# EAGLE design 8x8 (EAGLE 5.11)
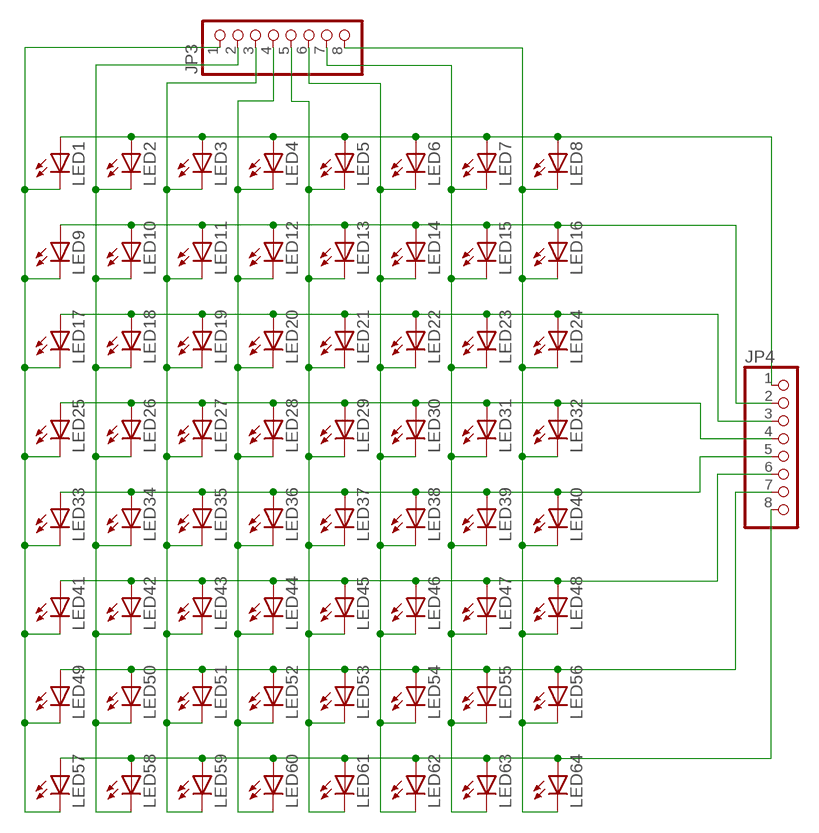
[diagram p0: schematic, sheet 1]

## Parts
JP3  PINHD-1X08_2.54-SMD  [1X08SMD]
JP4  PINHD-1X08_2.54-SMD  [1X08SMD]
LED1  LED5MM  [LED5MM]
LED2  LED5MM  [LED5MM]
LED3  LED5MM  [LED5MM]
LED4  LED5MM  [LED5MM]
LED5  LED5MM  [LED5MM]
LED6  LED5MM  [LED5MM]
LED7  LED5MM  [LED5MM]
LED8  LED5MM  [LED5MM]
LED9  LED5MM  [LED5MM]
LED10  LED5MM  [LED5MM]
LED11  LED5MM  [LED5MM]
LED12  LED5MM  [LED5MM]
LED13  LED5MM  [LED5MM]
LED14  LED5MM  [LED5MM]
LED15  LED5MM  [LED5MM]
LED16  LED5MM  [LED5MM]
LED17  LED5MM  [LED5MM]
LED18  LED5MM  [LED5MM]
LED19  LED5MM  [LED5MM]
LED20  LED5MM  [LED5MM]
LED21  LED5MM  [LED5MM]
LED22  LED5MM  [LED5MM]
LED23  LED5MM  [LED5MM]
LED24  LED5MM  [LED5MM]
LED25  LED5MM  [LED5MM]
LED26  LED5MM  [LED5MM]
LED27  LED5MM  [LED5MM]
LED28  LED5MM  [LED5MM]
LED29  LED5MM  [LED5MM]
LED30  LED5MM  [LED5MM]
LED31  LED5MM  [LED5MM]
LED32  LED5MM  [LED5MM]
LED33  LED5MM  [LED5MM]
LED34  LED5MM  [LED5MM]
LED35  LED5MM  [LED5MM]
LED36  LED5MM  [LED5MM]
LED37  LED5MM  [LED5MM]
LED38  LED5MM  [LED5MM]
LED39  LED5MM  [LED5MM]
LED40  LED5MM  [LED5MM]
LED41  LED5MM  [LED5MM]
LED42  LED5MM  [LED5MM]
LED43  LED5MM  [LED5MM]
LED44  LED5MM  [LED5MM]
LED45  LED5MM  [LED5MM]
LED46  LED5MM  [LED5MM]
LED47  LED5MM  [LED5MM]
LED48  LED5MM  [LED5MM]
LED49  LED5MM  [LED5MM]
LED50  LED5MM  [LED5MM]
LED51  LED5MM  [LED5MM]
LED52  LED5MM  [LED5MM]
LED53  LED5MM  [LED5MM]
LED54  LED5MM  [LED5MM]
LED55  LED5MM  [LED5MM]
LED56  LED5MM  [LED5MM]
LED57  LED5MM  [LED5MM]
LED58  LED5MM  [LED5MM]
LED59  LED5MM  [LED5MM]
LED60  LED5MM  [LED5MM]
LED61  LED5MM  [LED5MM]
LED62  LED5MM  [LED5MM]
LED63  LED5MM  [LED5MM]
LED64  LED5MM  [LED5MM]

## Nets
N$1: JP4.1 LED1.A LED2.A LED3.A LED4.A LED5.A LED6.A LED7.A LED8.A
N$2: JP4.2 LED9.A LED10.A LED11.A LED12.A LED13.A LED14.A LED15.A LED16.A
N$3: JP4.3 LED17.A LED18.A LED19.A LED20.A LED21.A LED22.A LED23.A LED24.A
N$4: JP4.4 LED25.A LED26.A LED27.A LED28.A LED29.A LED30.A LED31.A LED32.A
N$5: JP4.5 LED33.A LED34.A LED35.A LED36.A LED37.A LED38.A LED39.A LED40.A
N$6: JP4.6 LED41.A LED42.A LED43.A LED44.A LED45.A LED46.A LED47.A LED48.A
N$7: JP4.7 LED49.A LED50.A LED51.A LED52.A LED53.A LED54.A LED55.A LED56.A
N$8: JP4.8 LED57.A LED58.A LED59.A LED60.A LED61.A LED62.A LED63.A LED64.A
N$9: JP3.1 LED1.K(C) LED9.K(C) LED17.K(C) LED25.K(C) LED33.K(C) LED41.K(C) LED49.K(C) LED57.K(C)
N$10: JP3.2 LED2.K(C) LED10.K(C) LED18.K(C) LED26.K(C) LED34.K(C) LED42.K(C) LED50.K(C) LED58.K(C)
N$11: JP3.3 LED3.K(C) LED11.K(C) LED19.K(C) LED27.K(C) LED35.K(C) LED43.K(C) LED51.K(C) LED59.K(C)
N$12: JP3.4 LED4.K(C) LED12.K(C) LED20.K(C) LED28.K(C) LED36.K(C) LED44.K(C) LED52.K(C) LED60.K(C)
N$13: JP3.5 LED5.K(C) LED13.K(C) LED21.K(C) LED29.K(C) LED37.K(C) LED45.K(C) LED53.K(C) LED61.K(C)
N$14: JP3.6 LED6.K(C) LED14.K(C) LED22.K(C) LED30.K(C) LED38.K(C) LED46.K(C) LED54.K(C) LED62.K(C)
N$15: JP3.7 LED7.K(C) LED15.K(C) LED23.K(C) LED31.K(C) LED39.K(C) LED47.K(C) LED55.K(C) LED63.K(C)
N$16: JP3.8 LED8.K(C) LED16.K(C) LED24.K(C) LED32.K(C) LED40.K(C) LED48.K(C) LED56.K(C) LED64.K(C)

## Library data of the parts
JP3 JP4 = pinhead-2:PINHD-1X08: PIN HEADER
LED1-LED64 = SparkFun:LED: LEDs Standard schematic elements and footprints for 5mm, 3mm, 1206, and 0603 sized LEDs. 5mm - Spark Fun Electronics SKU : COM-00529 (and others)

## Board
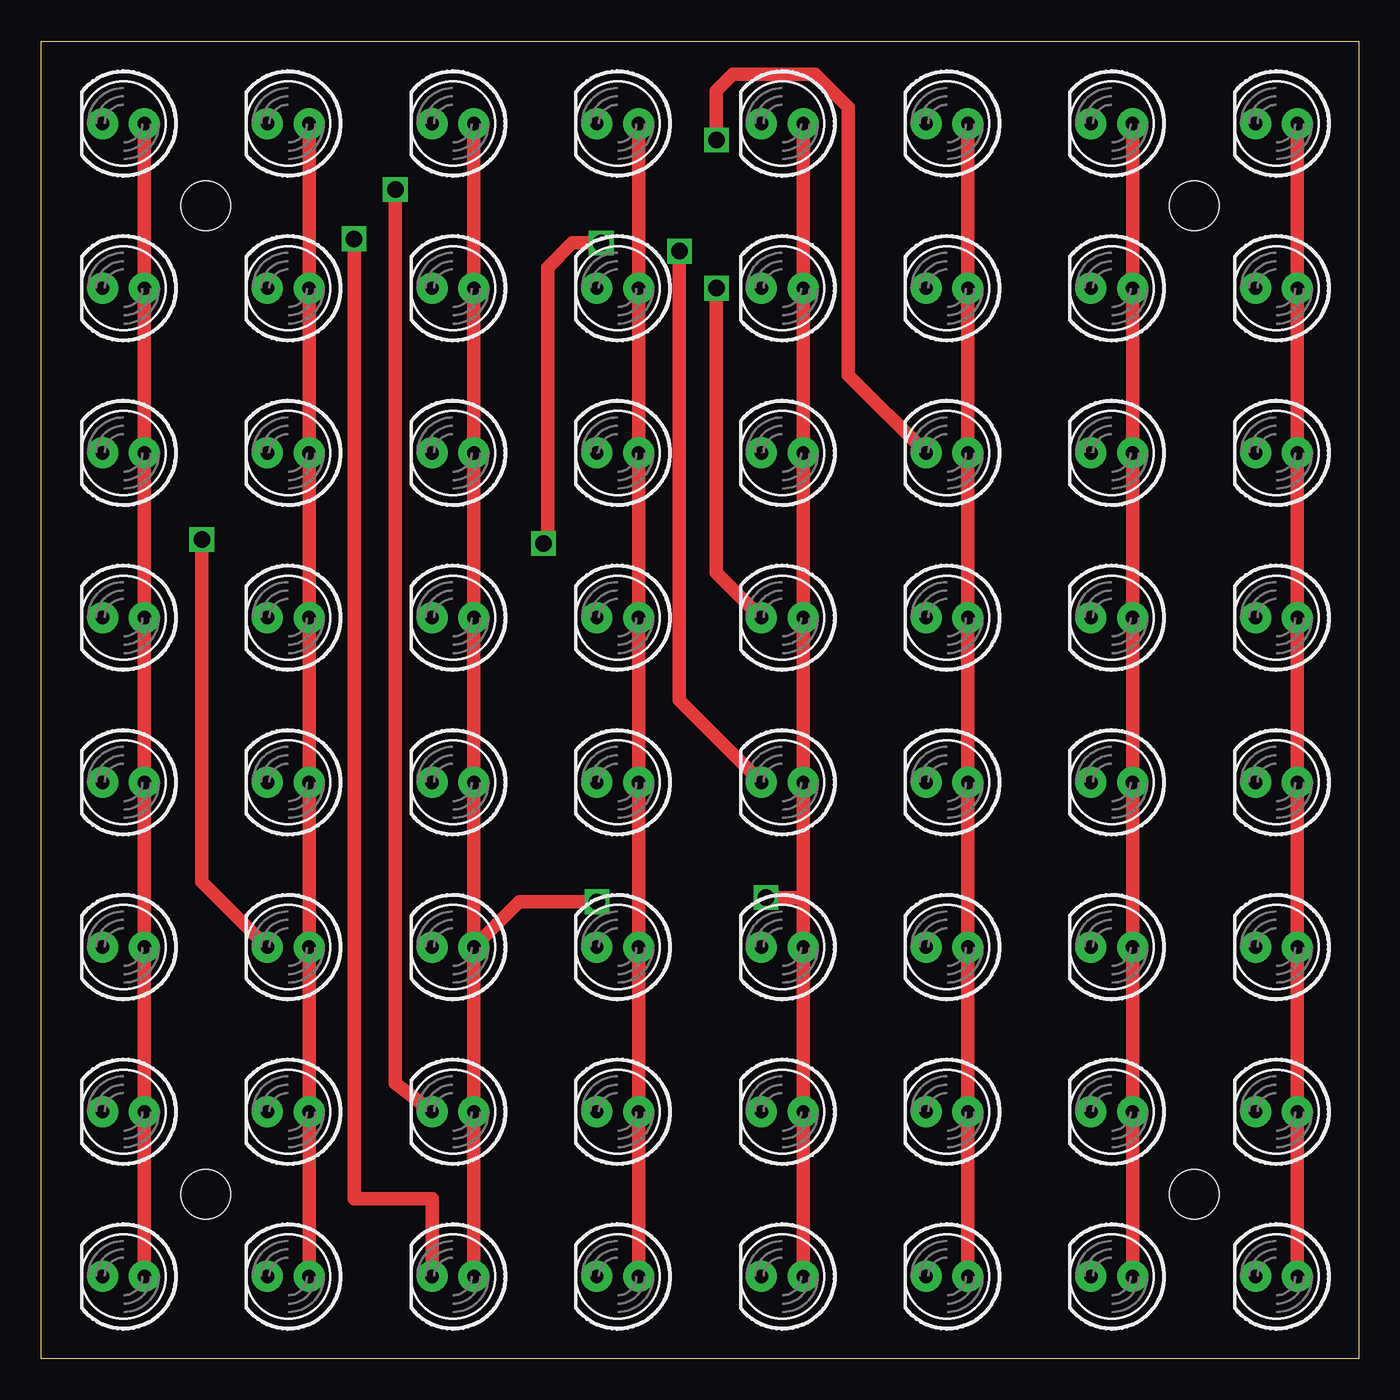
[diagram p1: board, top side]
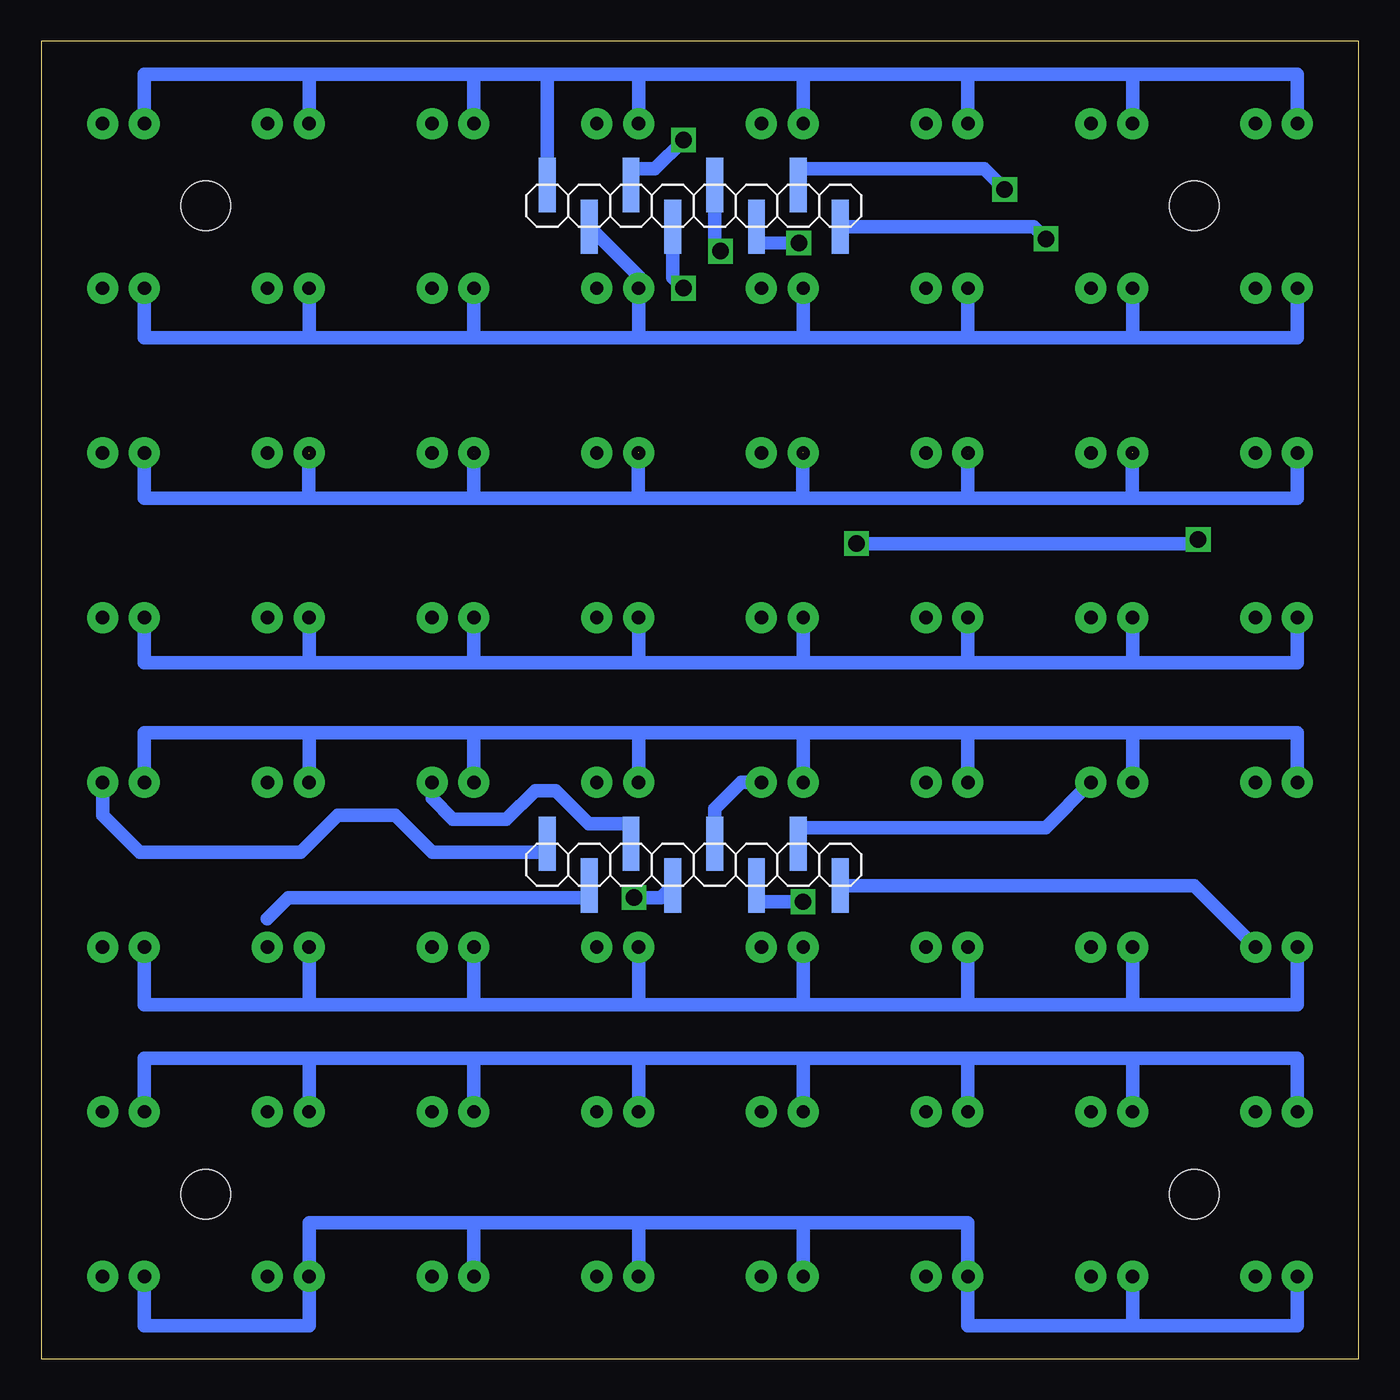
[diagram p2: board, bottom side, seen from below]

Size 80 x 80 mm. Coordinates in mm from the lower left corner, seen from the top.
Outline: 80,0 0,0 0,80 80,80 80,0
Copper layers (1*16): Top 0.035mm / dielectric 1.5mm / Bottom 0.035mm
Design rules "default *": minimum track width 10mil, minimum drill 24mil, track to track 38mil, track to pad 28mil, pad to pad 26mil, via to via 38mil, smd to smd 8mil, copper to edge 40mil, drill to drill 8mil, minimum pad ring 10mil, minimum via ring 8mil, stop-mask expansion 4mil, vias tented up to drill 40mil, thermal gap 10mil
Holes 3 mm at 70,70 10,70 10,10 70,10

### Footprints (pad centres in the part's own frame; a part is rotated, then mirrored left to right if it is on the bottom)
1X08SMD = smd 1.016 x 3.302: 1 -1.27,1.27; 2 1.27,-1.27; 3 3.81,1.27; 4 6.35,-1.27; 5 8.89,1.27; 6 11.43,-1.27; 7 13.97,1.27; 8 16.51,-1.27
LED5MM = drill 0.813 pad 1.88 round: A -1.27,0; K 1.27,0

### Placement (x,y rotation side)
JP3  48,70 0 bottom
JP4  48,30 0 bottom
LED1  75,75 180 top
LED2  75,65 180 top
LED3  75,55 180 top
LED4  75,45 180 top
LED5  75,35 180 top
LED6  75,25 180 top
LED7  75,15 180 top
LED8  75,5 180 top
LED9  65,75 180 top
LED10  65,65 180 top
LED11  65,55 180 top
LED12  65,45 180 top
LED13  65,35 180 top
LED14  65,25 180 top
LED15  65,15 180 top
LED16  65,5 180 top
LED17  55,75 180 top
LED18  55,65 180 top
LED19  55,55 180 top
LED20  55,45 180 top
LED21  55,35 180 top
LED22  55,25 180 top
LED23  55,15 180 top
LED24  55,5 180 top
LED25  45,75 180 top
LED26  45,65 180 top
LED27  45,55 180 top
LED28  45,45 180 top
LED29  45,35 180 top
LED30  45,25 180 top
LED31  45,15 180 top
LED32  45,5 180 top
LED33  35,75 180 top
LED34  35,65 180 top
LED35  35,55 180 top
LED36  35,45 180 top
LED37  35,35 180 top
LED38  35,25 180 top
LED39  35,15 180 top
LED40  35,5 180 top
LED41  25,75 180 top
LED42  25,65 180 top
LED43  25,55 180 top
LED44  25,45 180 top
LED45  25,35 180 top
LED46  25,25 180 top
LED47  25,15 180 top
LED48  25,5 180 top
LED49  15,75 180 top
LED50  15,65 180 top
LED51  15,55 180 top
LED52  15,45 180 top
LED53  15,35 180 top
LED54  15,25 180 top
LED55  15,15 180 top
LED56  15,5 180 top
LED57  5,75 180 top
LED58  5,65 180 top
LED59  5,55 180 top
LED60  5,45 180 top
LED61  5,35 180 top
LED62  5,25 180 top
LED63  5,15 180 top
LED64  5,5 180 top

### Tracks (layer width: path | path; a pad name or v marks a point on that pad's centre or on a via)
N$1
  Top 0.813: LED1.A LED2.A LED3.A LED4.A LED5.A LED6.A LED7.A LED8.A
  Bottom 0.813: LED5.A 76.27,33 74.02,30.75 71.25,30.75 64.25,30.75 63,32 62,33 58.5,33 56.25,30.75 49.27,30.75 JP4.1
N$2  (1 unrouted)
  Top 0.813: LED9.A LED10.A LED11.A LED12.A LED13.A LED14.A | LED14.A LED15.A LED16.A | LED14.A 66.27,26.73
  Bottom 0.813: JP4.2 46.73,28 57,28 65,28 66.27,26.73
N$3
  Top 0.813: LED24.A LED23.A LED22.A LED21.A LED20.A LED19.A LED18.A LED17.A
  Bottom 0.813: JP4.3 44.19,32.5 46.75,32.5 48.75,34.5 50,34.5 51.75,32.75 55,32.75 56.27,34.02 LED21.A
N$4  (via drill 1)
  Top 0.813: LED25.A LED26.A LED27.A LED28.A LED29.A 46.27,28 | 46.27,28 LED30.A LED31.A LED32.A | 46.27,28 v44,28
  Bottom 0.813: JP4.4 42.38,28 v44,28
N$5
  Top 0.813: LED33.A LED34.A LED35.A LED36.A LED37.A LED38.A LED39.A LED40.A
  Bottom 0.813: JP4.5 39.11,33.39 38.25,34.25 37.5,35 LED37.A
N$6  (via drill 1)
  Top 0.813: LED41.A LED42.A LED43.A LED44.A LED45.A LED46.A | LED46.A LED47.A LED48.A | v33.75,27.75 29.02,27.75 LED46.A
  Bottom 0.813: JP4.6 36.57,27.75 v33.75,27.75
N$7
  Top 0.813: LED49.A LED50.A LED51.A LED52.A 16.27,35.5 | 16.27,35.5 LED53.A | LED56.A LED55.A LED54.A 16.27,35.5
  Bottom 0.813: JP4.7 34.03,32.25 22.25,32.25 19.02,32.25 LED53.A
N$8
  Top 0.813: LED57.A LED58.A LED59.A LED60.A LED61.A LED62.A LED63.A LED64.A
  Bottom 0.813: JP4.8 10,28.73 LED62.A
N$9
  Bottom 0.813: LED1.K 73.73,78 64,78 | 63.73,78 64,78 | 54,78 63.73,78 | 53.73,78 54,78 | 51,78 53.73,78 | 44,78 51,78 | 43.73,78 44,78 | 34,78 43.73,78 | 33.73,78 34,78 | 24,78 33.73,78 | 23.73,78 24,78 | 15,78 23.73,78 | 13.73,78 15,78 | 13.73,78 4,78 3.73,78 LED57.K | 13.73,78 LED49.K | 13.73,78 15,78 | 23.73,78 LED41.K | 23.73,78 24,78 | 33.73,78 LED33.K | 33.73,78 34,78 | 43.73,78 LED25.K | 43.73,78 44,78 | 53.73,78 LED17.K | 53.73,78 54,78 | 63.73,78 LED9.K | 63.73,78 64,78 | JP3.1 49.27,78 51,78
N$10
  Bottom 0.813: LED2.K 73.73,62 64,62 | 63.73,62 64,62 | 54,62 63.73,62 | 53.73,62 54,62 | 44,62 53.73,62 | 43.73,62 44,62 | 34,62 43.73,62 | 33.73,62 34,62 | 24,62 33.73,62 | 23.73,62 24,62 | 14,62 23.73,62 | 13.73,62 14,62 | 13.73,62 4,62 3.73,62 LED58.K | 13.73,62 LED50.K | 13.73,62 14,62 | 23.73,62 LED42.K | 23.73,62 24,62 | 33.73,62 LED34.K | 33.73,62 34,62 | 43.73,62 LED26.K 43.73,65.73 JP3.2 | 43.73,62 44,62 | 53.73,62 LED18.K | 53.73,62 54,62 | 63.73,62 LED10.K | 63.73,62 64,62
N$11  (via drill 1)  (6 unrouted)
  Top 0.813: v41,74 41,77 42,78 47,78 49,76 49,59.73 LED19.K
  Bottom 0.813: LED3.K 73.73,52.25 63.75,52.25 | 53.75,52.25 63.75,52.25 | 43.75,52.25 53.75,52.25 | 33.75,52.25 43.75,52.25 | 23.75,52.25 33.75,52.25 | 13.75,52.25 23.75,52.25 | 13.75,52.25 4.5,52.25 3.73,52.25 LED59.K | 63.75,52.25 63.75,55 | 43.75,52.25 43.75,55 | 33.75,52.25 33.75,55 | 23.75,52.25 23.75,55 | 13.75,52.25 13.75,55 | 53.75,52.25 53.75,55 | v41,74 42.75,72.25 43.25,72.25 44.19,72.25 JP3.3
N$12  (via drill 1)
  Top 0.813: v41,65 41,47.73 LED28.K
  Bottom 0.813: JP3.4 41.65,65.65 v41,65 | LED4.K 73.73,42.25 63.73,42.25 | 63.5,42.25 63.73,42.25 | 53.73,42.25 63.5,42.25 | 53.5,42.25 53.73,42.25 | 43.73,42.25 53.5,42.25 | 43.5,42.25 43.73,42.25 | 33.75,42.25 43.5,42.25 | 33.73,42.25 33.75,42.25 | 23.75,42.25 33.73,42.25 | 23.73,42.25 23.75,42.25 | 13.73,42.25 23.73,42.25 | 13.5,42.25 13.73,42.25 | 13.5,42.25 4,42.25 3.73,42.25 LED60.K | 63.73,42.25 LED12.K | 63.5,42.25 63.73,42.25 | 53.73,42.25 LED20.K | 53.5,42.25 53.73,42.25 | 33.73,42.25 LED36.K | 33.73,42.25 33.75,42.25 | 23.73,42.25 LED44.K | 23.73,42.25 23.75,42.25 | 13.73,42.25 LED52.K | 13.5,42.25 13.73,42.25 | 43.73,42.25 LED28.K | 43.5,42.25 43.73,42.25
N$13  (via drill 1)
  Top 0.813: LED29.K 38.75,39.98 v38.75,67.25
  Bottom 0.813: LED5.K 73.73,38 64,38 | 63.73,38 64,38 | 53.73,38 63.73,38 | 53.5,38 53.73,38 | 44,38 53.5,38 | 43.73,38 44,38 | 33.75,38 43.73,38 | 33.73,38 33.75,38 | 23.75,38 33.73,38 | 23.73,38 23.75,38 | 13.75,38 23.73,38 | 13.73,38 13.75,38 | 13.73,38 5,38 3.73,38 LED61.K | 63.73,38 LED13.K | 63.73,38 64,38 | 53.73,38 LED21.K | 53.5,38 53.73,38 | 33.73,38 LED37.K | 33.73,38 33.75,38 | 23.73,38 LED45.K | 23.73,38 23.75,38 | 13.73,38 LED53.K | 13.73,38 13.75,38 | 43.73,38 LED29.K | 43.73,38 44,38 | v38.75,67.25 39.11,67.61 JP3.5
N$14  (via drill 1)
  Top 0.813: v34,67.75 32.25,67.75 30.75,66.25 30.75,49.75 v30.5,49.5 | v9.75,49.75 9.75,28.98 LED54.K
  Bottom 0.813: JP3.6 36.48,67.73 v34,67.75 | v30.5,49.5 10,49.5 v9.75,49.75 | LED6.K 73.73,21.5 63.75,21.5 | 63.73,21.5 63.75,21.5 | 53.75,21.5 63.73,21.5 | 53.73,21.5 53.75,21.5 | 43.75,21.5 53.73,21.5 | 43.73,21.5 43.75,21.5 | 33.75,21.5 43.73,21.5 | 33.73,21.5 33.75,21.5 | 23.75,21.5 33.73,21.5 | 23.73,21.5 23.75,21.5 | 13.75,21.5 23.73,21.5 | 13.73,21.5 13.75,21.5 | 13.73,21.5 5,21.5 3.73,21.5 LED62.K | 13.73,21.5 LED54.K | 13.73,21.5 13.75,21.5 | 23.73,21.5 LED46.K | 23.73,21.5 23.75,21.5 | 33.73,21.5 LED38.K | 33.73,21.5 33.75,21.5 | 43.73,21.5 LED30.K | 43.73,21.5 43.75,21.5 | 53.73,21.5 LED22.K | 53.73,21.5 53.75,21.5 | 63.73,21.5 LED14.K | 63.73,21.5 63.75,21.5
N$15  (via drill 1)
  Top 0.813: v21.5,71 21.5,16.73 LED47.K
  Bottom 0.813: LED7.K 73.73,18.25 63.75,18.25 | 63.73,18.25 63.75,18.25 | 53.75,18.25 63.73,18.25 | 53.73,18.25 53.75,18.25 | 43.75,18.25 53.73,18.25 | 43.73,18.25 43.75,18.25 | 33.73,18.25 43.73,18.25 | 33.25,18.25 33.73,18.25 | 24.25,18.25 33.25,18.25 | 23.73,18.25 24.25,18.25 | 13.75,18.25 23.73,18.25 | 13.73,18.25 13.75,18.25 | 13.73,18.25 5,18.25 3.73,18.25 LED63.K | 23.73,18.25 LED47.K | 23.73,18.25 24.25,18.25 | 13.73,18.25 LED55.K | 13.73,18.25 13.75,18.25 | 33.73,18.25 LED39.K | 33.25,18.25 33.73,18.25 | 43.73,18.25 LED31.K | 43.73,18.25 43.75,18.25 | 53.73,18.25 LED23.K | 53.73,18.25 53.75,18.25 | 63.73,18.25 LED15.K | 63.73,18.25 63.75,18.25 | JP3.7 34.03,72.25 25,72.25 22.75,72.25 v21.5,71
N$16  (via drill 1)
  Top 0.813: v19,68 19,9.73 23.73,9.73 LED48.K
  Bottom 0.813: JP3.8 19.73,68.73 v19,68 | 53.75,8.25 63.5,8.25 63.73,8.25 LED16.K 63.73,2 65,2 73.73,2 LED8.K | 53.73,8.25 53.75,8.25 | 43.73,8.25 53.73,8.25 | 43.5,8.25 43.73,8.25 | 33.73,8.25 43.5,8.25 | 33.5,8.25 33.73,8.25 | 33.5,8.25 23.73,8.25 LED48.K 23.73,2 13.73,2 | 53.73,8.25 LED24.K | 53.73,8.25 53.75,8.25 | 43.73,8.25 LED32.K | 43.5,8.25 43.73,8.25 | 33.73,8.25 LED40.K | 33.5,8.25 33.73,8.25 | LED64.K 3.73,2 12.5,2 13.73,2 | 13.73,2 LED56.K